# Altium schematic sheet yard-ice-toplevel.SchDoc: Yard-Ice-Top
size 365 x 274 mm; Revision: 1.0; SheetNumber: 1; SheetTotal: 5
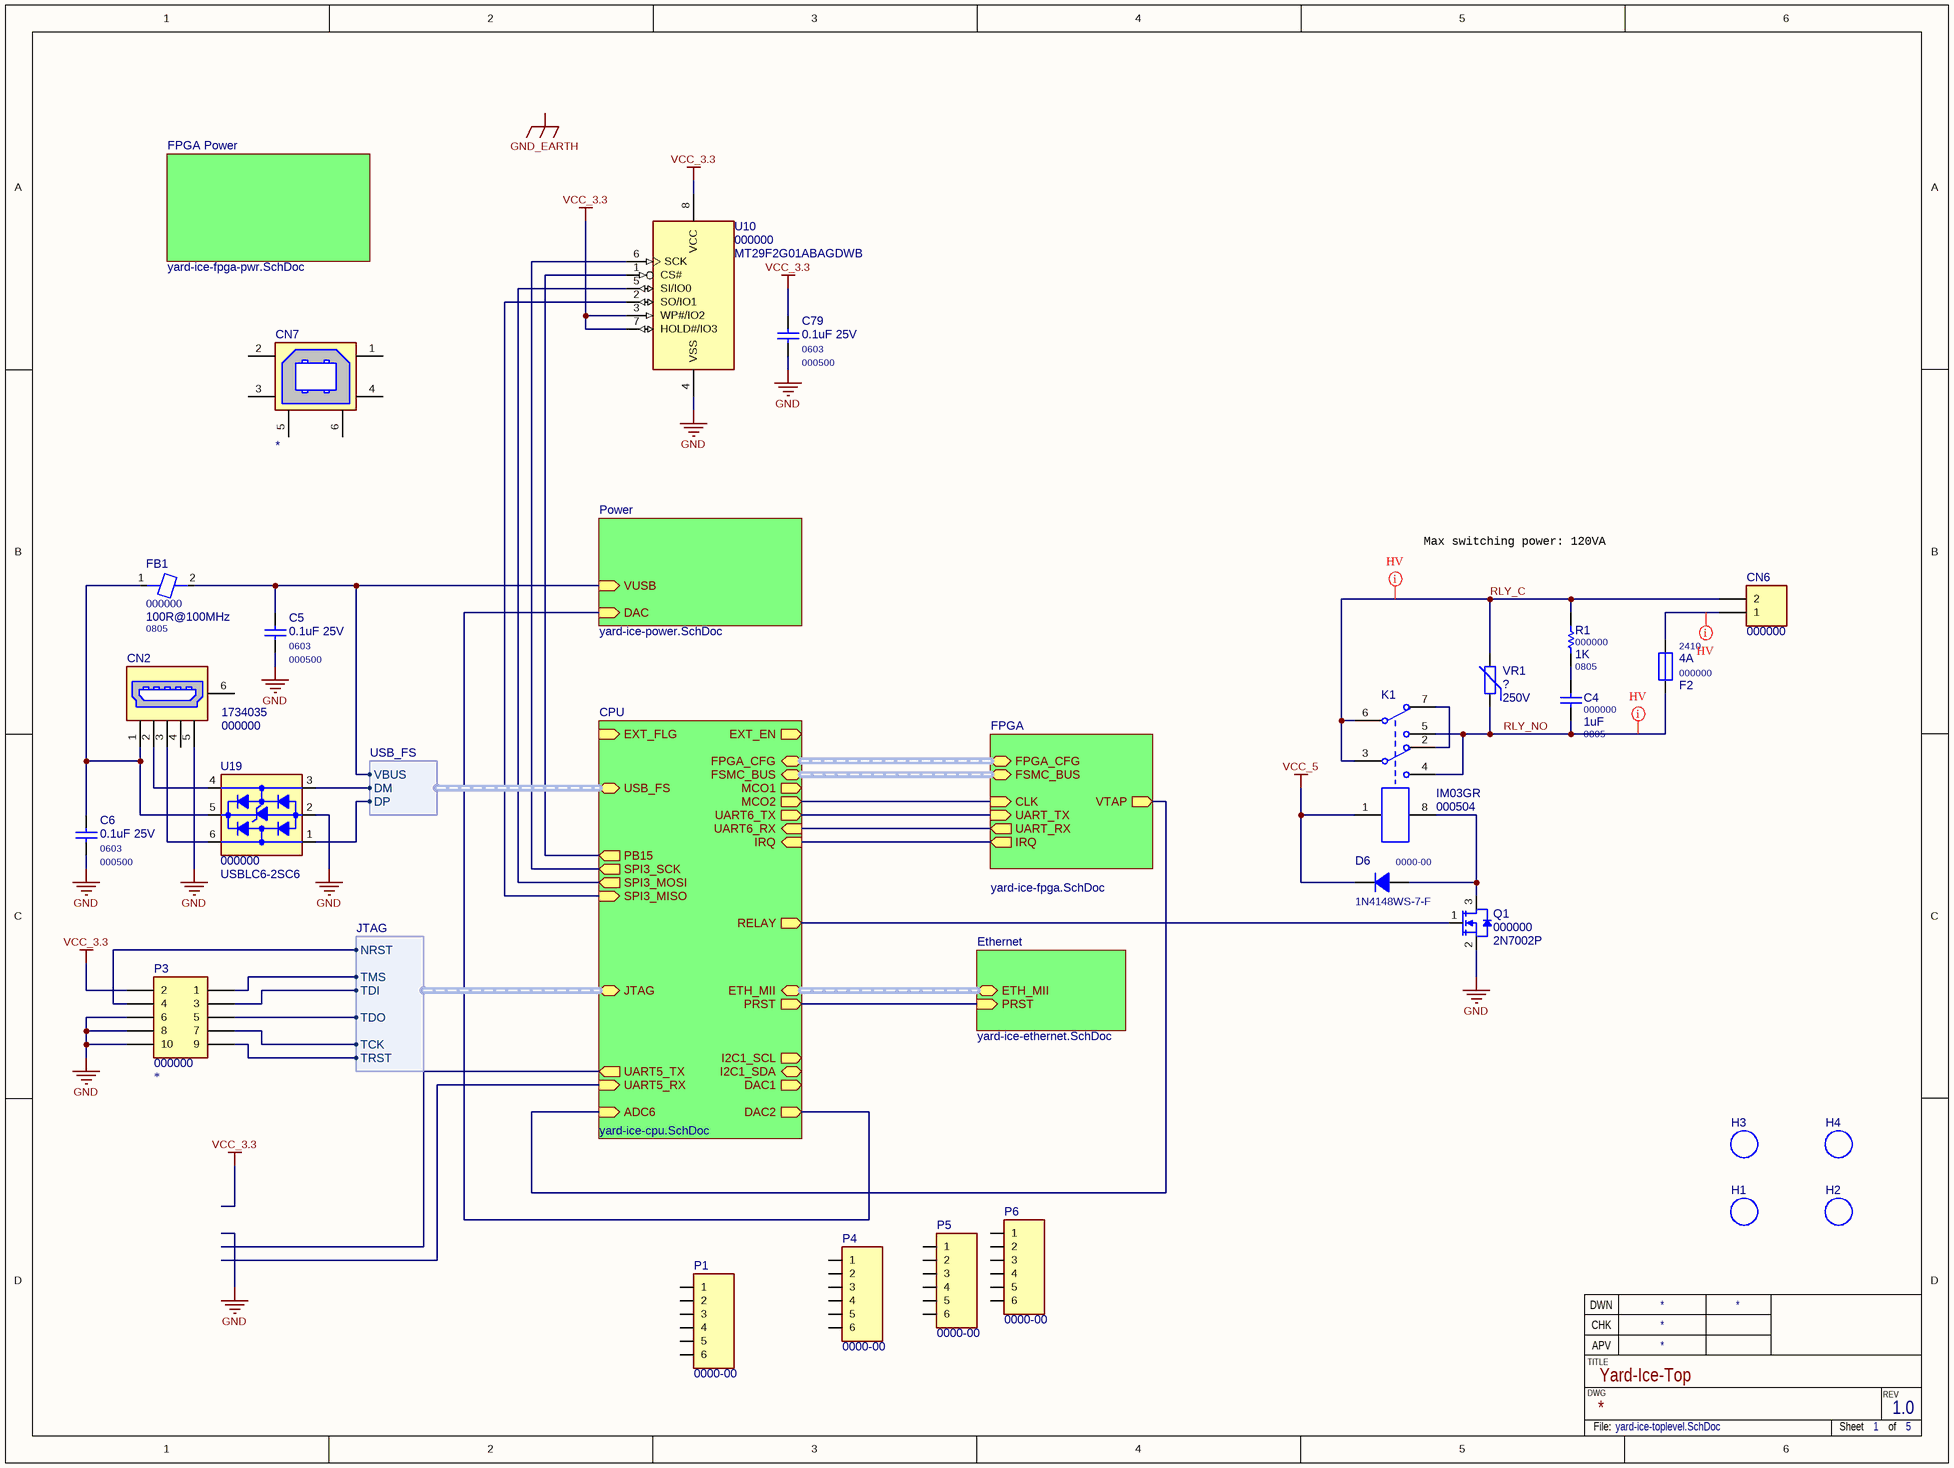
[diagram p0: yard-ice-toplevel.SchDoc]

## Parts
C4  000000  value 1uF  Package: 0805  [C0805HV]
C5  000500  value 0.1uF 25V  Package: 0603  [C0603M]
C6  000500  value 0.1uF 25V  Package: 0603  [C0603M]
C79  000500  value 0.1uF 25V  Package: 0603  [C0603M]
CN2  value 1734035  [1734035]  (hidden comment: 000000)
CN6  000000  [691322110002]
CN7  *  [4-1734376]
D6  0000-00  MF PN: 1N4148WS-7-F  [SOD-323-M]
F2  000000  value 4A  Package: 2410  [F2410]
FB1  000000  value 100R@100MHz  Package: 0805  [L0805M]
H1  Hole Non Plated  [Hole NP 3.2x5.0x5.0]  (value not drawn)
H2  Hole Non Plated  [Hole NP 3.2x5.0x5.0]  (value not drawn)
H3  Hole Non Plated  [Hole NP 3.2x5.0x5.0]  (value not drawn)
H4  Hole Non Plated  [Hole NP 3.2x5.0x5.0]  (value not drawn)
K1  000504  value IM03GR  [Relay-10X6]
P1  0000-00  [SsW-106-01-G-S]
P3  000000  [TSW-105-07-G-D]
P4  0000-00  [SsW-106-01-G-S]
P5  0000-00  [SsW-106-01-G-S]
P6  0000-00  [SsW-106-01-G-S]
Q1  000000  value 2N7002P  [SOT-23-M]
R1  000000  value 1K  Package: 0805  [R0805HV]
U10  000000  value MT29F2G01ABAGDWB  [U-PDFN-8]
U19  000000  value USBLC6-2SC6  [SOT23-6L]
VR1  ?  value 250V  [MOV7x4.8-5.0]

## Sub-sheets
CPU = yard-ice-cpu.SchDoc: ETH_MII (harness ETH_MII), FSMC_BUS (harness FSMC_BUS), FPGA_CFG (harness FPGA_CFG), PRST (out), MCO2 (out), USB_FS (harness USB_FS), JTAG (harness JTAG), EXT_EN (out), EXT_FLG (in), ADC6 (in), DAC2 (out), I2C1_SDA (bidir), I2C1_SCL (out), UART6_TX (out), UART6_RX (in), UART5_TX (out), UART5_RX (in), RELAY (out), IRQ (in), DAC1 (out), SPI3_MISO (in), SPI3_MOSI (out), SPI3_SCK (out), PB15 (out), MCO1 (out)
Ethernet = yard-ice-ethernet.SchDoc: ETH_MII (harness ETH_MII), PRST (in)
FPGA = yard-ice-fpga.SchDoc: FSMC_BUS (harness FSMC_BUS), FPGA_CFG (harness FPGA_CFG), CLK (in), VTAP (out), UART_TX (in), UART_RX (out), IRQ (out)
FPGA Power = yard-ice-fpga-pwr.SchDoc: no entries
Power = yard-ice-power.SchDoc: VUSB (in), DAC (in)

## Harnesses
USB_FS: VBUS, DM, DP
JTAG: TDO, TDI, TCK, TMS, TRST, NRST

## Nets
GND: C5.2 C6.2 C79.2 CN2.5(SHIELD) P3.6 P3.8 P3.10 Q1.2(S) U10.4(VSS) U19.2(GND)
VCC_3.3: C79.1 P3.2 U10.3(WP#/IO2) U10.7(HOLD#/IO3) U10.8(VCC)
VCC_5: D6.2(K) K1.1
RLY_C: CN6.2 K1.3 K1.6 R1.2 VR1.2
RLY_NO: C4.2 F2.1 K1.4 K1.5 VR1.1
NetC4_1: C4.1 R1.1
NetC5_1: C5.1 FB1.2 ; sheet Power/VUSB, sheet CPU/USB_FS.VBUS
NetC6_1: C6.1 CN2.1 FB1.1 U19.5(VBUS)
NetCN2_2: CN2.2 U19.4(I/O2)
NetCN2_3: CN2.3 U19.6(I/O1)
NetCN6_1: CN6.1 F2.2
NetD6_1: D6.1(A) K1.8 Q1.3(D)
NetK1_2: K1.2 K1.7
NetP3_1: P3.1 ; sheet CPU/JTAG.TMS
NetP3_3: P3.3 ; sheet CPU/JTAG.TDI
NetP3_4: P3.4 ; sheet CPU/JTAG.NRST
NetP3_5: P3.5 ; sheet CPU/JTAG.TDO
NetP3_7: P3.7 ; sheet CPU/JTAG.TCK
NetP3_9: P3.9 ; sheet CPU/JTAG.TRST
NetQ1_1: Q1.1(G) ; sheet CPU/RELAY
NetU10_1: U10.1(CS#) ; sheet CPU/PB15
NetU10_2: U10.2(SO/IO1) ; sheet CPU/SPI3_MISO
NetU10_5: U10.5(SI/IO0) ; sheet CPU/SPI3_MOSI
NetU10_6: U10.6(SCK) ; sheet CPU/SPI3_SCK
NetU19_1: U19.1(IO/1) ; sheet CPU/USB_FS.DP
NetU19_3: U19.3(IO/2) ; sheet CPU/USB_FS.DM
(unnamed): sheet Power/DAC, sheet CPU/DAC2
(unnamed): sheet CPU/PRST, sheet Ethernet/PRST
(unnamed): sheet CPU/MCO2, sheet FPGA/CLK
(unnamed): sheet CPU/ADC6, sheet FPGA/VTAP
(unnamed): sheet CPU/UART6_TX, sheet FPGA/UART_TX
(unnamed): sheet CPU/UART6_RX, sheet FPGA/UART_RX
(unnamed): sheet CPU/IRQ, sheet FPGA/IRQ

Not connected (* = marked no-connect by the designer): CN2 4 6(SHIELD); CN7 1 2 3 4 5(SHIELD) 6(SHIELD); P1 1 2 3 4 5 6; P4 1 2 3 4 5 6; P5 1 2 3 4 5 6; P6 1 2 3 4 5 6

## Buses and harness runs
harness sheet CPU/ETH_MII = sheet Ethernet/ETH_MII
harness sheet CPU/FPGA_CFG = sheet FPGA/FPGA_CFG
harness sheet CPU/FSMC_BUS = sheet FPGA/FSMC_BUS

## Layout directives
net class HV: NetCN6_1, RLY_C, RLY_NO

## Notes on the sheet
- Max switching power: 120VA
- Labels drawn without touching a wire or pin: GND_EARTH
- TITLE
- CHK
- DWN
- APV
- DWG
- REV
- File:
- Sheet
- of

## Library data of the parts
C4 = C0805: SMD Ceramic Chip Capacitor - 0805; PN: 000000; ExtraInfo: *
C5 C6 C79 = C0603: SMD Ceramic Chip Capacitor - 0603 - X7R; MF PN: C1608X7R1E104K; MF: TDK; PN: 000500
CN2 = 1734035: USB Type B Mini - Right Angle - SMD; MF: Tyco; MF PN: 1734035-3; Package: SMT; PN: 000000; Digi-Key PN: A121553CT-ND; Price: 1.16131; Status: Stock
CN6 = Term Blk 2: Terminal Block, Header, 2-Pos; PN: 000000; Package: PTH; Value: *; ExtraInfo: *
CN7 = 4-1734376: USB Type B - Right Angle - Thru Hole; PN: *; Value: *; Package: *; ExtraInfo: *
D6 = 1N4148WS: Fast Switching Diode 100V 150mA; MF: Diodes Inc; PN: 0000-00; Package: SOD-323; ExtraInfo: *
F2 = F2410: PN: 000000; ExtraInfo: *; MF: *; MF PN: *
FB1 = FB0805: SMD Chip Ferrite Bead - 0805; PN: 000000; ExtraInfo: *; MF: *; MF PN: *
K1 = Relay-DPDT: Dual-Pole Dual-Throw Relay; MF: Tyco; PN: 000504; Package: SMT; MF PN: IM03GR
P1 P4-P6 = Header 6: Header, 6-Pin; MF: Samtec; Package: *; PN: 0000-00; ExtraInfo: *; Value: *
P3 = Header 5X2: Socket 5-Pin, Dual row; PN: 000000; Package: SMD; Value: *; ExtraInfo: *
Q1 = 2N7002P: N-Channel MOSFET 60V 360mA SOT-23; PN: 000000; Package: SOT-23; ExtraInfo: *
R1 = R0805: SMD Chip Resistor - 0805; PN: 000000; ExtraInfo: *
U10 = MT29F2G01ABAGDWB: 2Gb NANDl Flash Memory,  133MHz, SPI; MF: Micron; MF PN: MT29F2G01ABAGDWB-IT:G TR; PN: 000000; Package: 8VDFN; ExtraInfo: *; Digi-Key PN: 557-1664-1-ND; Price: 3.52500
U19 = USBLC6-2SC6: USB ESD Protection; PN: 0000-00; MF: STMicroelectronics; Package: ST23-6L; ExtraInfo: *; Digi-Key PN: 497-5235-1-ND; MF PN: USBLC6-2SC6; Price: 0.14025; Status: Stock
VR1 = Varistor: Varistor (Voltage-Sensitive Resistor); PN: ?; MF PN: *; Package: PTH; ExtraInfo: *; MF: *; Price: *; Digi-Key PN: *